# EasyEDA schematic 1-Schematic_ac todc.json
TITLE: Sheet_1; REV: 1.0; Date: 2021-08-26; Sheet: 1/1; Drawn By: ibrahim00; Company: Your Company
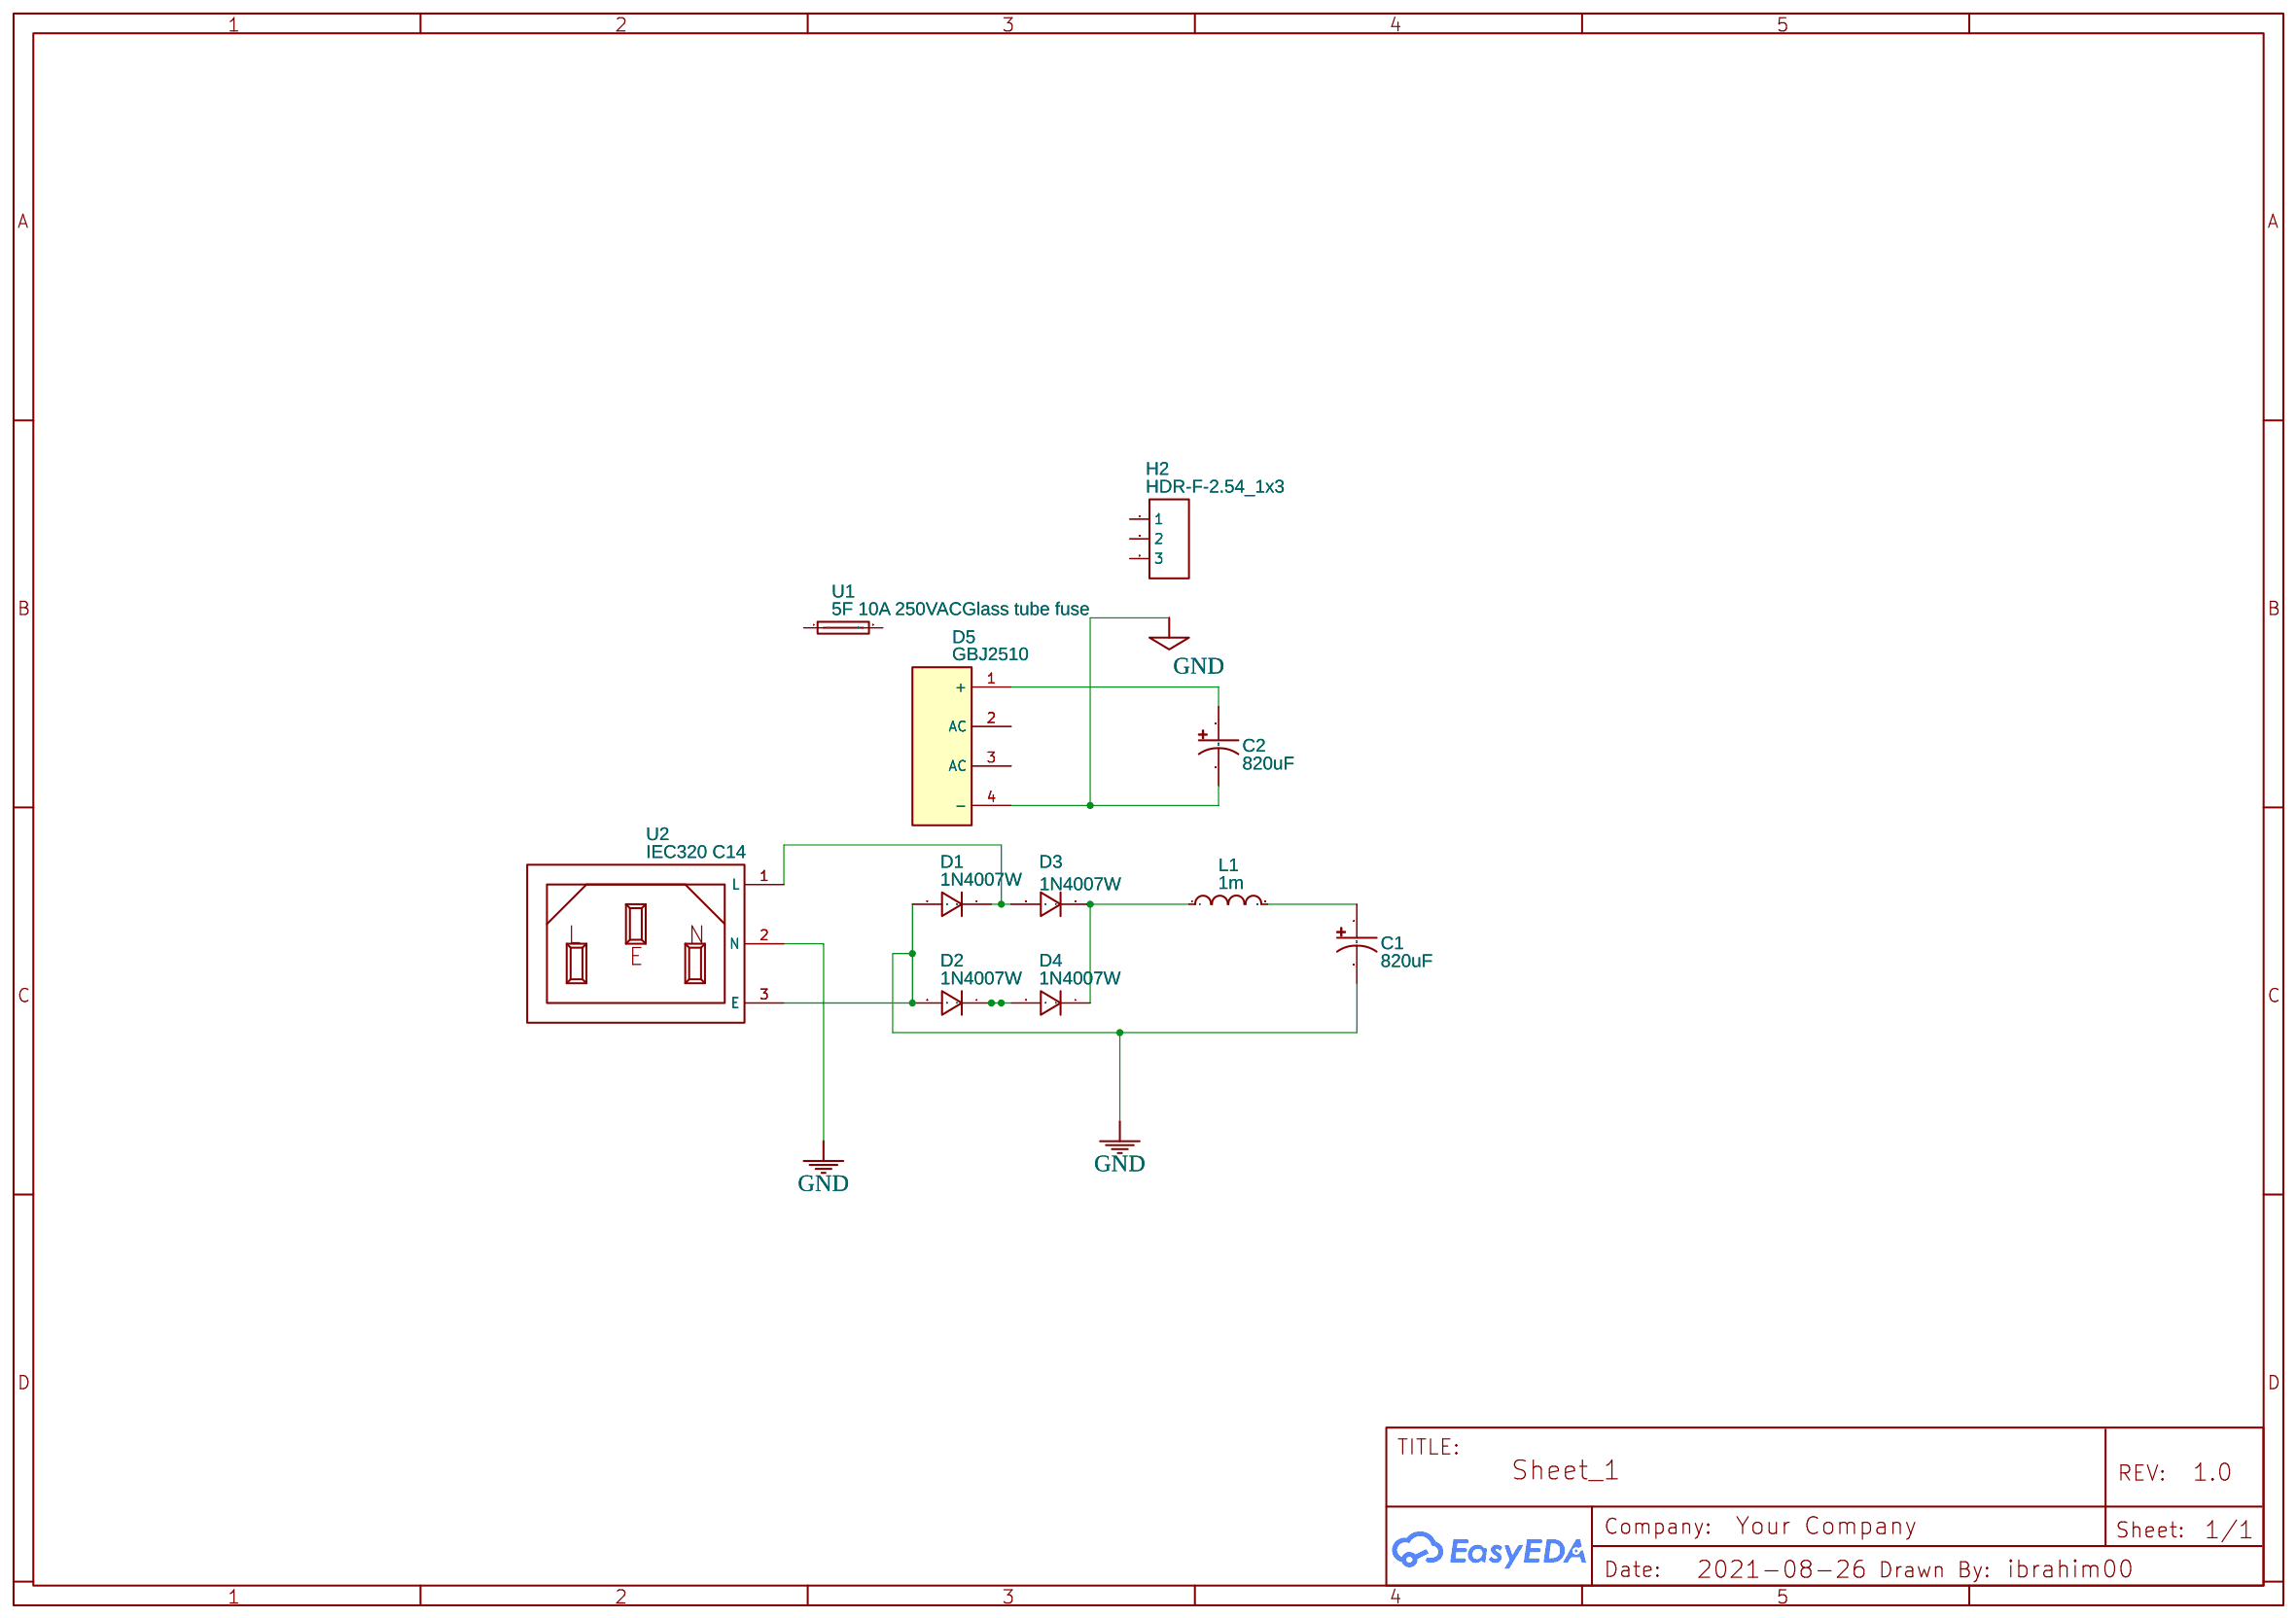
[diagram p0: schematic sheet]

## Parts
C1  820uF  [CAP-TH_BD35.0-P10.00-D2.3-FD]
C2  820uF  [CAP-TH_BD35.0-P10.00-D2.3-FD]
D1  1N4007W  [SOD-123_L2.8-W1.8-LS3.7-RD]
D2  1N4007W  [SOD-123_L2.8-W1.8-LS3.7-RD]
D3  1N4007W  [SOD-123_L2.8-W1.8-LS3.7-RD]
D4  1N4007W  [SOD-123_L2.8-W1.8-LS3.7-RD]
D5  GBJ2510  [DIO-BG-TH_PB]
H2  HDR-F-2.54_1x3  [HDR-F-2.54_1X3]
L1  1m  [L0603]
U1  5F 10A 250VACGlass tube fuse  [FUSE-SMD_5-20MM]
U2  IEC320 C14  [BULGIN_PX0575/20/PC]

## Library data of the parts
C1 C2 = TDC-400V820-35*45: Supplier: LCSC; Supplier Part: C350238; Manufacturer: SamYoung Electronics; Contributor: LCSC; JLCPCB Part Class: Extended Part
D1-D4 = 1N4007W: Supplier: LCSC; Supplier Part: C328592; Manufacturer: BLUE ROCKET; Contributor: LCEDA_Lib
D5 = GBJ2510: Supplier: LCSC; Manufacturer: MDD; Supplier Part: C27523; JLCPCB Part Class: Extended Part
H2 = HDR-F-2.54_1x3: Supplier Part: C146690; Supplier: LCSC; Contributor: LCEDA_Lib
L1 = L0603_US: Contributor: LCEDA_Lib
U1 = 5F 10A 250VACGlass tube fuse: Supplier: LCSC; Manufacturer: XCFuse; Supplier Part: C3122; JLCPCB Part Class: Extended Part
U2 = IEC320 C14: Contributor: dimitar.kunchev

## Nets
GND: C1.2 C2.2 D1.2 D2.2 D5.4(-) U2.2(N) U2.3(E)
Net-(C1-1): C1.1 L1.2
Net-(C2-1): C2.1 D5.1(+)
Net-(D1-1): D1.1 D3.2 U2.1(L)
Net-(D2-1): D2.1 D4.2
Net-(D3-1): D3.1 D4.1 L1.1

Not connected (* = marked no-connect by the designer): D5 2(AC) 3(AC); H2 1 2 3; U1 1 2
